# EAGLE design NinjaPCB_ver2.2 (EAGLE 6.6.0)
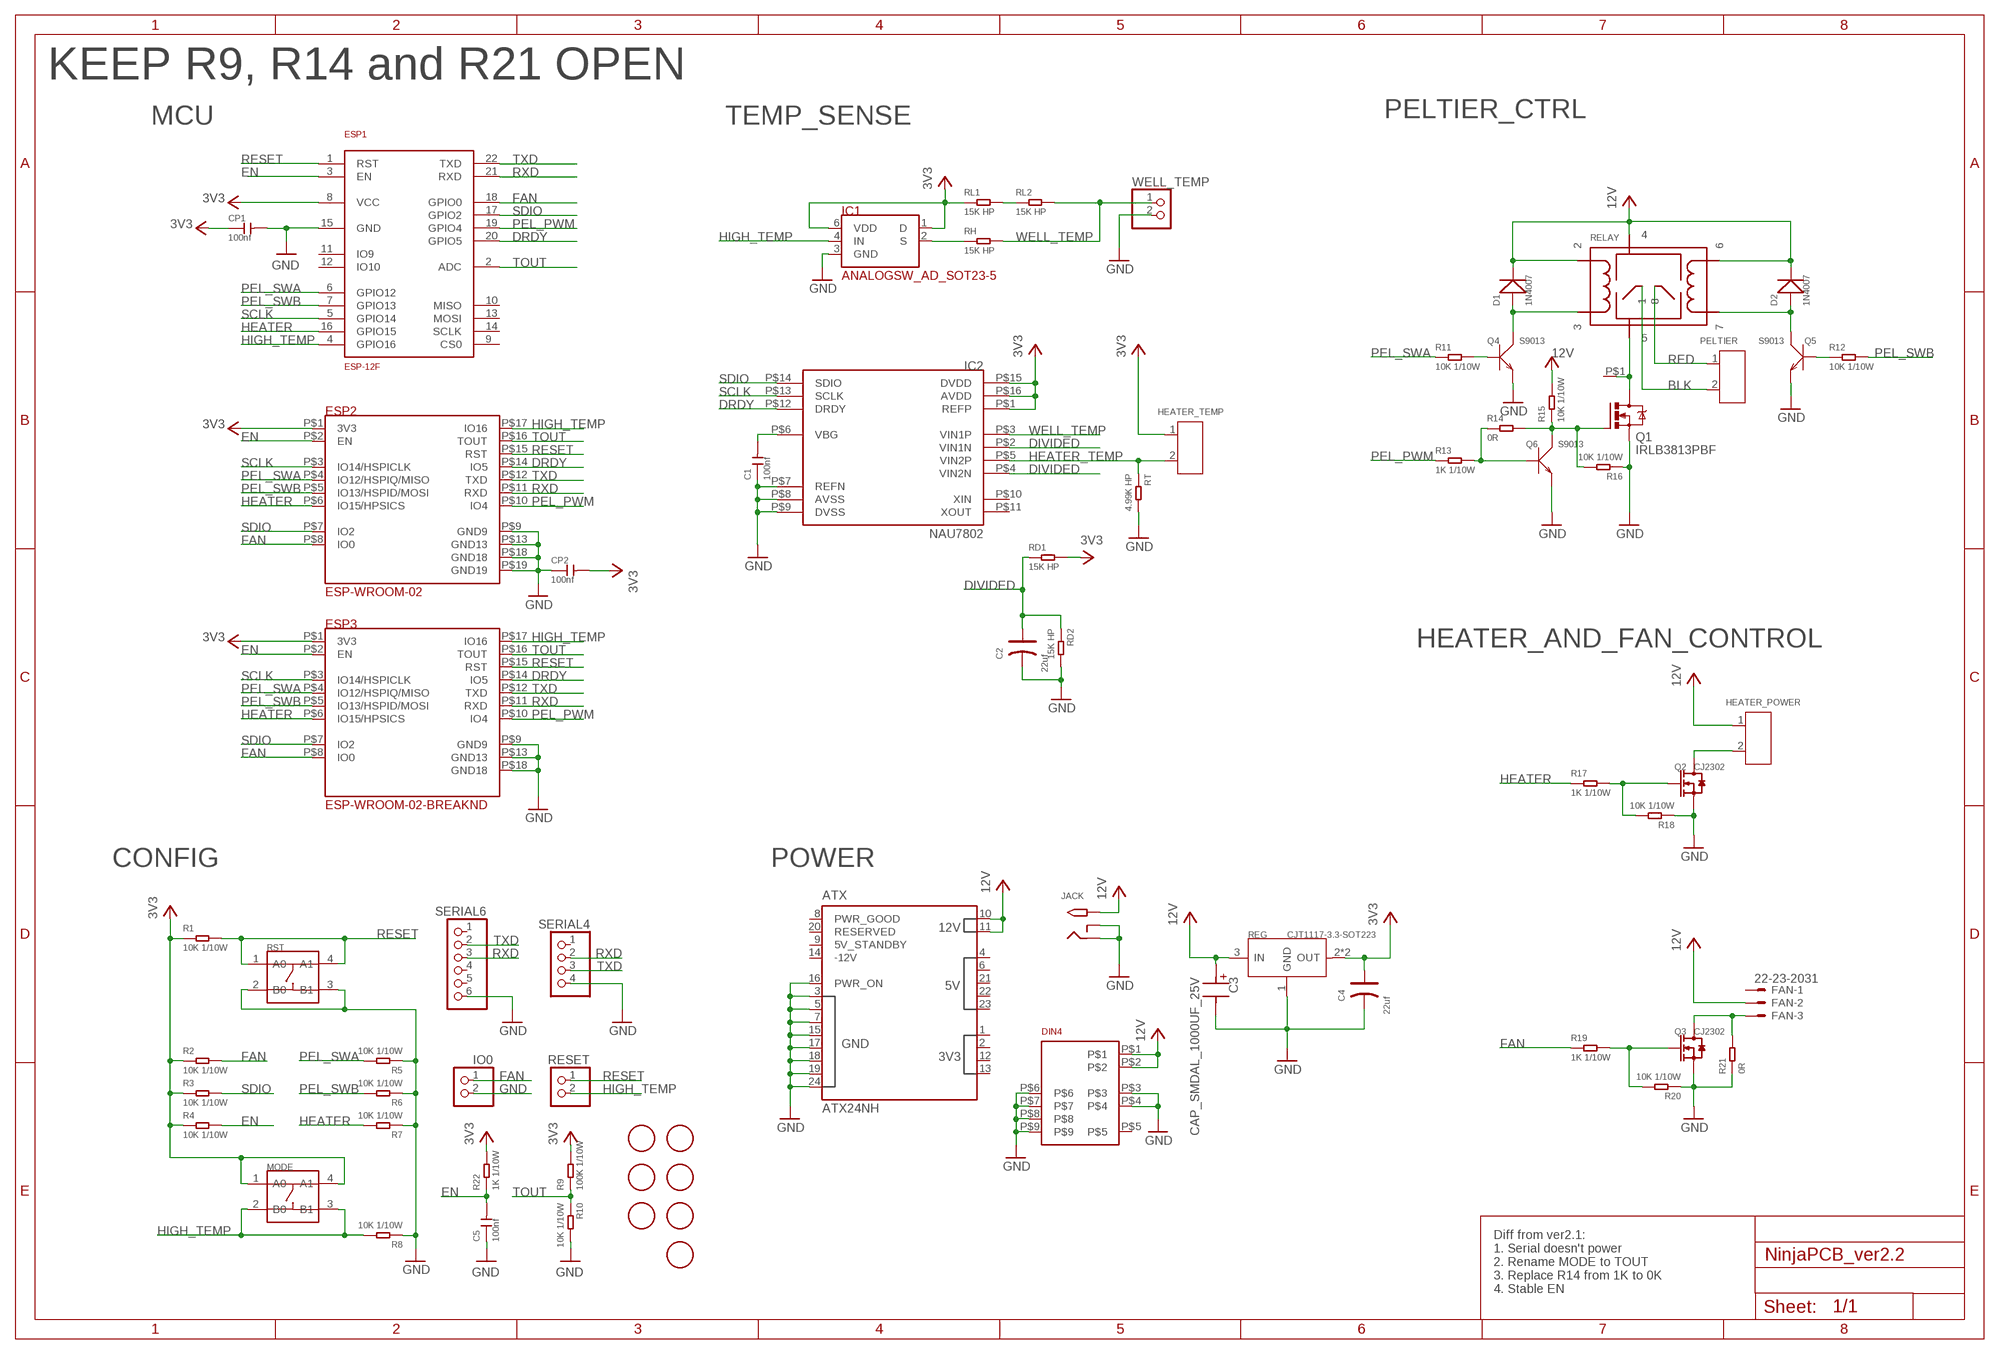
[diagram p0: schematic, sheet 1]

## Parts
ATX  ATX24NH  [ATX24]
C1  100nf  CERAMIC-100NF-50V-10%-X7R(0603)  [C0603]
C2  22uf  TANTALUM-SMD-22UF-16V(AVX-B)  [AVX-B]
C3  CAP_SMDAL_1000UF_25V  [CAP_SMD_AL_D125]
C4  22uf  TANTALUM-SMD-22UF-16V(AVX-B)  [AVX-B]
C5  100nf  CERAMIC-100NF-50V-10%-X7R(0603)  [C0603]
CP1  100nf  CERAMIC-100NF-50V-10%-X7R(0603)  [C0603]
CP2  100nf  CERAMIC-100NF-50V-10%-X7R(0603)  [C0603]
D1  1N4007  DIODE-GEN-PURPOSE-1KV-1A(DO-214AC)  [DO-214AC]
D2  1N4007  DIODE-GEN-PURPOSE-1KV-1A(DO-214AC)  [DO-214AC]
DIN4  DIN4  [DIN4]
ESP1  ESP-12F  [ESP-12F]
ESP2  ESP-WROOM-02  [ESP-WROOM-02]
ESP3  ESP-WROOM-02-BREAKND  [ESP-WROOM-02-BREAK-NODETAIL]
FAN  22-23-2031  [22-23-2031]
HEATER_POWER  SCREW-TERMINAL-GREEN(2P-3.5)  [H2-3.5-7.0X7.0MM]
HEATER_TEMP  SCREW-TERMINAL-GREEN(2P-3.5)  [H2-3.5-7.0X7.0MM]
HEATSINK  HEAT111PB015  [HEAT11PB015]
IC1  ANALOGSW_AD_SOT23-5  [SOT23-5]
IC2  NAU7802  [SOP-16]
IO0  PINHD-1X2  [1X02]
JACK  2.1MMJACKTHM-NOOUT  [PJ-102A-NOOUT]
MODE  DIP-SWITCH-TACTILE-SPST-NO/TS-1109(4P-D6.0MM)'TS-1109'  [SW4-6.0X6.0X5.0MM]
PELTIER  SCREW-TERMINAL-GREEN(2P-3.5)  [H2-3.5-7.0X7.0MM]
Q1  IRLB3813PBF  IRF520  [TO220BV]
Q2  CJ2302  SMD-MOSFET-N-CH-20V-2.1A-CJ2302(SOT-23)  [SOT-23]
Q3  CJ2302  SMD-MOSFET-N-CH-20V-2.1A-CJ2302(SOT-23)  [SOT-23]
Q4  S9013  SMD-TRANSISTORS-NPN-25V-500MA-S9013(SOT-23)  [SOT-23]
Q5  S9013  SMD-TRANSISTORS-NPN-25V-500MA-S9013(SOT-23)  [SOT-23]
Q6  S9013  SMD-TRANSISTORS-NPN-25V-500MA-S9013(SOT-23)  [SOT-23]
R1  10K 1/10W  SMD-RES-10K-5%-1/10W(0603)  [R0603]
R2  10K 1/10W  SMD-RES-10K-5%-1/10W(0603)  [R0603]
R3  10K 1/10W  SMD-RES-10K-5%-1/10W(0603)  [R0603]
R4  10K 1/10W  SMD-RES-10K-5%-1/10W(0603)  [R0603]
R5  10K 1/10W  SMD-RES-10K-5%-1/10W(0603)  [R0603]
R6  10K 1/10W  SMD-RES-10K-5%-1/10W(0603)  [R0603]
R7  10K 1/10W  SMD-RES-10K-5%-1/10W(0603)  [R0603]
R8  10K 1/10W  SMD-RES-10K-5%-1/10W(0603)  [R0603]
R9  100K 1/10W  SMD-RES-100K-5%-1/10W(0603)  [R0603]
R10  10K 1/10W  SMD-RES-10K-5%-1/10W(0603)  [R0603]
R11  10K 1/10W  SMD-RES-10K-5%-1/10W(0603)  [R0603]
R12  10K 1/10W  SMD-RES-10K-5%-1/10W(0603)  [R0603]
R13  1K 1/10W  SMD-RES-1K-5%-1/10W(0603)  [R0603]
R14  0R  SMD-RES-0R-5%-1/10W(0603)  [R0603]
R15  10K 1/10W  SMD-RES-10K-5%-1/10W(0603)  [R0603]
R16  10K 1/10W  SMD-RES-10K-5%-1/10W(0603)  [R0603]
R17  1K 1/10W  SMD-RES-1K-5%-1/10W(0603)  [R0603]
R18  10K 1/10W  SMD-RES-10K-5%-1/10W(0603)  [R0603]
R19  1K 1/10W  SMD-RES-1K-5%-1/10W(0603)  [R0603]
R20  10K 1/10W  SMD-RES-10K-5%-1/10W(0603)  [R0603]
R21  0R  SMD-RES-0R-5%-1/10W(0603)  [R0603]
R22  1K 1/10W  SMD-RES-1K-5%-1/10W(0603)  [R0603]
RD1  15K HP  R0603  [R0603]
RD2  15K HP  R0603  [R0603]
REG  CJT1117-3.3-SOT223  PMIC-CJT1117-3.3(SOT223)  [SOT-223]
RELAY  NEC-RELAY2EP2  [NEC-EP2]
RESET  PINHD-1X2  [1X02]
RH  15K HP  R0603  [R0603]
RL1  15K HP  R0603  [R0603]
RL2  15K HP  R0603  [R0603]
RST  DIP-SWITCH-TACTILE-SPST-NO/TS-1109(4P-D6.0MM)'TS-1109'  [SW4-6.0X6.0X5.0MM]
RT  4.99K HP  SMD-RES-2K-1%-1/10W(0603)  [R0603]
SERIAL4  PINHD-1X4  [1X04]
SERIAL6  PINHD-1X6  [1X06]
U$3  FIDUCIAL  [FIDUCIAL_1MM]
U$4  FIDUCIAL  [FIDUCIAL_1MM]
U$5  FIDUCIAL  [FIDUCIAL_1MM]
U$7  FIDUCIAL  [FIDUCIAL_1MM]
U$8  FIDUCIAL  [FIDUCIAL_1MM]
U$9  FIDUCIAL  [FIDUCIAL_1MM]
U$10  FIDUCIAL  [FIDUCIAL_1MM]
WELL_TEMP  PINHD-1X2/90  [1X02/90]

## Nets
3V3: C4.+ CP1.1 CP2.2 ESP1.8(VCC) ESP2.P$1(3V3) ESP3.P$1(3V3) HEATER_TEMP.1 IC1.1(D) IC1.6(VDD) IC2.P$1(REFP) IC2.P$15(DVDD) IC2.P$16(AVDD) MODE.1(A0) MODE.4(A1) R1.1 R2.1 R3.1 R4.1 R9.2 R22.2 RD1.2 REG.2(OUT) REG.TER(OUT) RL1.1
12V: ATX.10(12V_10) ATX.11(12V_11) C3.P$P D1.2(-) D2.2(-) DIN4.P$1 DIN4.P$2 FAN.2 HEATER_POWER.1 JACK.TIP R15.2 REG.3(IN) RELAY.P$2 RELAY.P$4 RELAY.P$6
BLK: PELTIER.2 RELAY.P$1
DIVIDED: C2.+ IC2.P$2(VIN1N) IC2.P$4(VIN2N) RD1.1 RD2.1
DRDY: ESP1.20(GPIO5) ESP2.P$14(IO5) ESP3.P$14(IO5) IC2.P$12(DRDY)
EN: C5.2 ESP1.3(EN) ESP2.P$2(EN) ESP3.P$2(EN) R4.2 R22.1
FAN: ESP1.18(GPIO0) ESP2.P$8(IO0) ESP3.P$8(IO0) IO0.1 R2.2 R19.1
GND: ATX.3(GND3) ATX.5(GND5) ATX.7(GND7) ATX.15(GND15) ATX.16(PWR_ON) ATX.17(GND17) ATX.18(GND18) ATX.19(GND19) ATX.24(GND24) C1.1 C2.- C3.P$M C4.- C5.1 CP1.2 CP2.1 DIN4.P$3 DIN4.P$4 DIN4.P$6 DIN4.P$7 DIN4.P$8 DIN4.P$9 ESP1.15(GND) ESP2.P$9(GND9) ESP2.P$13(GND13) ESP2.P$18(GND18) ESP2.P$19(GND19) ESP3.P$9(GND9) ESP3.P$13(GND13) ESP3.P$18(GND18) IC1.3(GND) IC2.P$7(REFN) IC2.P$8(AVSS) IC2.P$9(DVSS) IO0.2 JACK.RING JACK.RING_SW Q1.S Q2.2(S) Q3.2(S) Q4.2(E) Q5.2(E) Q6.2(E) R5.1 R6.1 R7.1 R8.1 R10.2 R16.1 R18.1 R20.1 R21.1 RD2.2 REG.1(GND) RST.2(B0) RST.3(B1) RT.2 SERIAL4.4 SERIAL6.6 WELL_TEMP.2
HEATER: ESP1.16(GPIO15) ESP2.P$6(IO15/HPSICS) ESP3.P$6(IO15/HPSICS) R7.2 R17.1
HEATER_TEMP: HEATER_TEMP.2 IC2.P$5(VIN2P) RT.1
HIGH_TEMP: ESP1.4(GPIO16) ESP2.P$17(IO16) ESP3.P$17(IO16) IC1.4(IN) MODE.2(B0) MODE.3(B1) R8.2 RESET.2
N$1: RL1.2 RL2.1
N$2: HEATER_POWER.2 Q2.3(D)
N$3: HEATSINK.P$1 Q1.D RELAY.P$5
N$4: FAN.3 Q3.3(D) R21.2
N$5: Q1.G Q6.3(C) R14.2 R15.1 R16.2
N$8: Q3.1(G) R19.2 R20.2
N$27: IC1.2(S) RH.1
N$30: Q6.1(B) R13.2 R14.1
N$32: Q2.1(G) R17.2 R18.2
N$33: D1.1(+) Q4.3(C) RELAY.P$3
N$34: Q4.1(B) R11.2
N$35: Q5.1(B) R12.1
N$36: D2.1(+) Q5.3(C) RELAY.P$7
N$92: C1.2 IC2.P$6(VBG)
PEL_PWM: ESP1.19(GPIO4) ESP2.P$10(IO4) ESP3.P$10(IO4) R13.1
PEL_SWA: ESP1.6(GPIO12) ESP2.P$4(IO12/HSPIQ/MISO) ESP3.P$4(IO12/HSPIQ/MISO) R5.2 R11.1
PEL_SWB: ESP1.7(GPIO13) ESP2.P$5(IO13/HSPID/MOSI) ESP3.P$5(IO13/HSPID/MOSI) R6.2 R12.2
RED: PELTIER.1 RELAY.P$8
RESET: ESP1.1(RST) ESP2.P$15(RST) ESP3.P$15(RST) R1.2 RESET.1 RST.1(A0) RST.4(A1)
RXD: ESP1.21(RXD) ESP2.P$11(RXD) ESP3.P$11(RXD) SERIAL4.2 SERIAL6.3
SCLK: ESP1.5(GPIO14) ESP2.P$3(IO14/HSPICLK) ESP3.P$3(IO14/HSPICLK) IC2.P$13(SCLK)
SDIO: ESP1.17(GPIO2) ESP2.P$7(IO2) ESP3.P$7(IO2) IC2.P$14(SDIO) R3.2
TOUT: ESP1.2(ADC) ESP2.P$16(TOUT) ESP3.P$16(TOUT) R9.1 R10.1
TXD: ESP1.22(TXD) ESP2.P$12(TXD) ESP3.P$12(TXD) SERIAL4.3 SERIAL6.2
WELL_TEMP: IC2.P$3(VIN1P) RH.2 RL2.2 WELL_TEMP.1
Unconnected: ATX.1(3V3_1) ATX.2(3V3_2) ATX.4(5V_4) ATX.6(5V_6) ATX.8(PWR_GOOD) ATX.9(5V_STANDBY) ATX.12(3V3_12) ATX.13(3V3_13) ATX.14(-12V) ATX.20(RESERVED) ATX.21(5V_21) ATX.22(5V_22) ATX.23(5V_23) DIN4.P$5 ESP1.9(CS0) ESP1.10(MISO) ESP1.11(IO9) ESP1.12(IO10) ESP1.13(MOSI) ESP1.14(SCLK) FAN.1 IC2.P$10(XIN) IC2.P$11(XOUT) SERIAL4.1 SERIAL6.1 SERIAL6.4 SERIAL6.5

## Notes on the sheet
- KEEP R9, R14 and R21 OPEN
- MCU | TEMP_SENSE | PELTIER_CTRL
- HEATER_AND_FAN_CONTROL
- CONFIG | POWER
- Diff from ver2.1: 
  1. Serial doesn't power
  2. Rename MODE to TOUT
  3. Replace R14 from 1K to 0K
  4. Stable EN

## Library data of the parts
ATX = PCR-Connector:ATX24
C1 C5 CP1 CP2 = Seeed-Capacitor:CERAMIC-100NF-50V-10%-X7R(0603): 302010138; MPN: CC0603KRX7R9BB104
C2 C4 = Seeed-Capacitor:TANTALUM-SMD-22UF-16V(AVX-B): 302020013; MPN: TAJB226*016#NJ
C3 = Seeed-OPL-2017-01-Capacitor-akita:CAP_SMDAL_1000UF_25V: SMD CAP Aluminum 1000uF-25V;D12.5*H13.5mm SKU: 302030098
D1 D2 = Seeed-Diode:DIODE-GEN-PURPOSE-1KV-1A(DO-214AC): 304010013; MPN: 1N4007
DIN4 = PCR-Connector:DIN4
ESP1 = Seeed-OPL-2017-01-Sensor-camilo:ESP-12F: 317060163
ESP2 = PCR-Module:ESP-WROOM-02
ESP3 = PCR-Module:ESP-WROOM-02-BREAK
FAN = con-molex:22-23-2031: .100" (2.54mm) Center Header - 3 Pin; MF: MOLEX; MPN: 22-23-2031; OC_FARNELL: 1462950; OC_NEWARK: 30C0862
HEATER_POWER HEATER_TEMP PELTIER = Seeed-Connector:SCREW-TERMINAL-GREEN(2P-3.5): 320110028; VALUE: GREEN-2P-3.5
HEATSINK = PCR-Connector:HEAT1
IC1 = PCR-IC:ANALOGSW_AD_SOT23-5
IC2 = PCR-IC:NAU7802
IO0 RESET WELL_TEMP = pinhead:PINHD-1X2: PIN HEADER
JACK = adafruit:2.1MMJACK: 2.1mm x 5.5mm THM DC jack with internal switch. Digikey part #PJ-102A, 4UCON part #05537 2.1mm x 5.5mm SMT DC jack with internal switch. Digikey part #PJ-002A-SMT, 4UCON part #03267 By microbuilder.eu & adafruit.com
MODE RST = Seeed-Switch:DIP-SWITCH-TACTILE-SPST-NO/TS-1109(4P-D6.0MM): 311020024
Q1 = transistor-power:IRF520: HEXFET Power MOSFET
Q2 Q3 = Seeed-Transistor:SMD-MOSFET-N-CH-20V-2.1A-CJ2302(SOT-23): 305030015; MPN: CJ2302
Q4-Q6 = Seeed-Transistor:SMD-TRANSISTORS-NPN-25V-500MA-S9013(SOT-23): 305010018; MPN: S9013
R1-R8 R10-R12 R15 R16 R18 R20 = Seeed-Resistor:SMD-RES-10K-5%-1/10W(0603): 301010293; MPN: RC0603JR-0710KL
R9 = Seeed-Resistor:SMD-RES-100K-5%-1/10W(0603): 301010089; MPN: RC0603JR-07100KL
R13 R17 R19 R22 = Seeed-Resistor:SMD-RES-1K-5%-1/10W(0603): 301010291; MPN: RC0603JR-071KL
R14 R21 = Seeed-Resistor:SMD-RES-0R-5%-1/10W(0603): 301010292; MPN: RC0603JR-070RL
RD1 RD2 RH RL1 RL2 = PCR-RCL:R
REG = Seeed-IC:PMIC-CJT1117-3.3(SOT223): 310030097; MPN: CJT1117-3.3
RELAY = PCR-Switch:NEC-RELAY2
RT = Seeed-Resistor:SMD-RES-2K-1%-1/10W(0603): 301010221; MPN: RC0603FR-072KL; VALUE: 2K
SERIAL4 = pinhead:PINHD-1X4: PIN HEADER
SERIAL6 = pinhead:PINHD-1X6: PIN HEADER
U$3-U$5 U$7-U$10 = adafruit:FIDUCIAL: For use by pick and place machines to calibrate the vision/machine, 1mm By microbuilder.eu

## Net classes
1 2A: width 0.406 mm
2 8A: width 2.54 mm

## Board
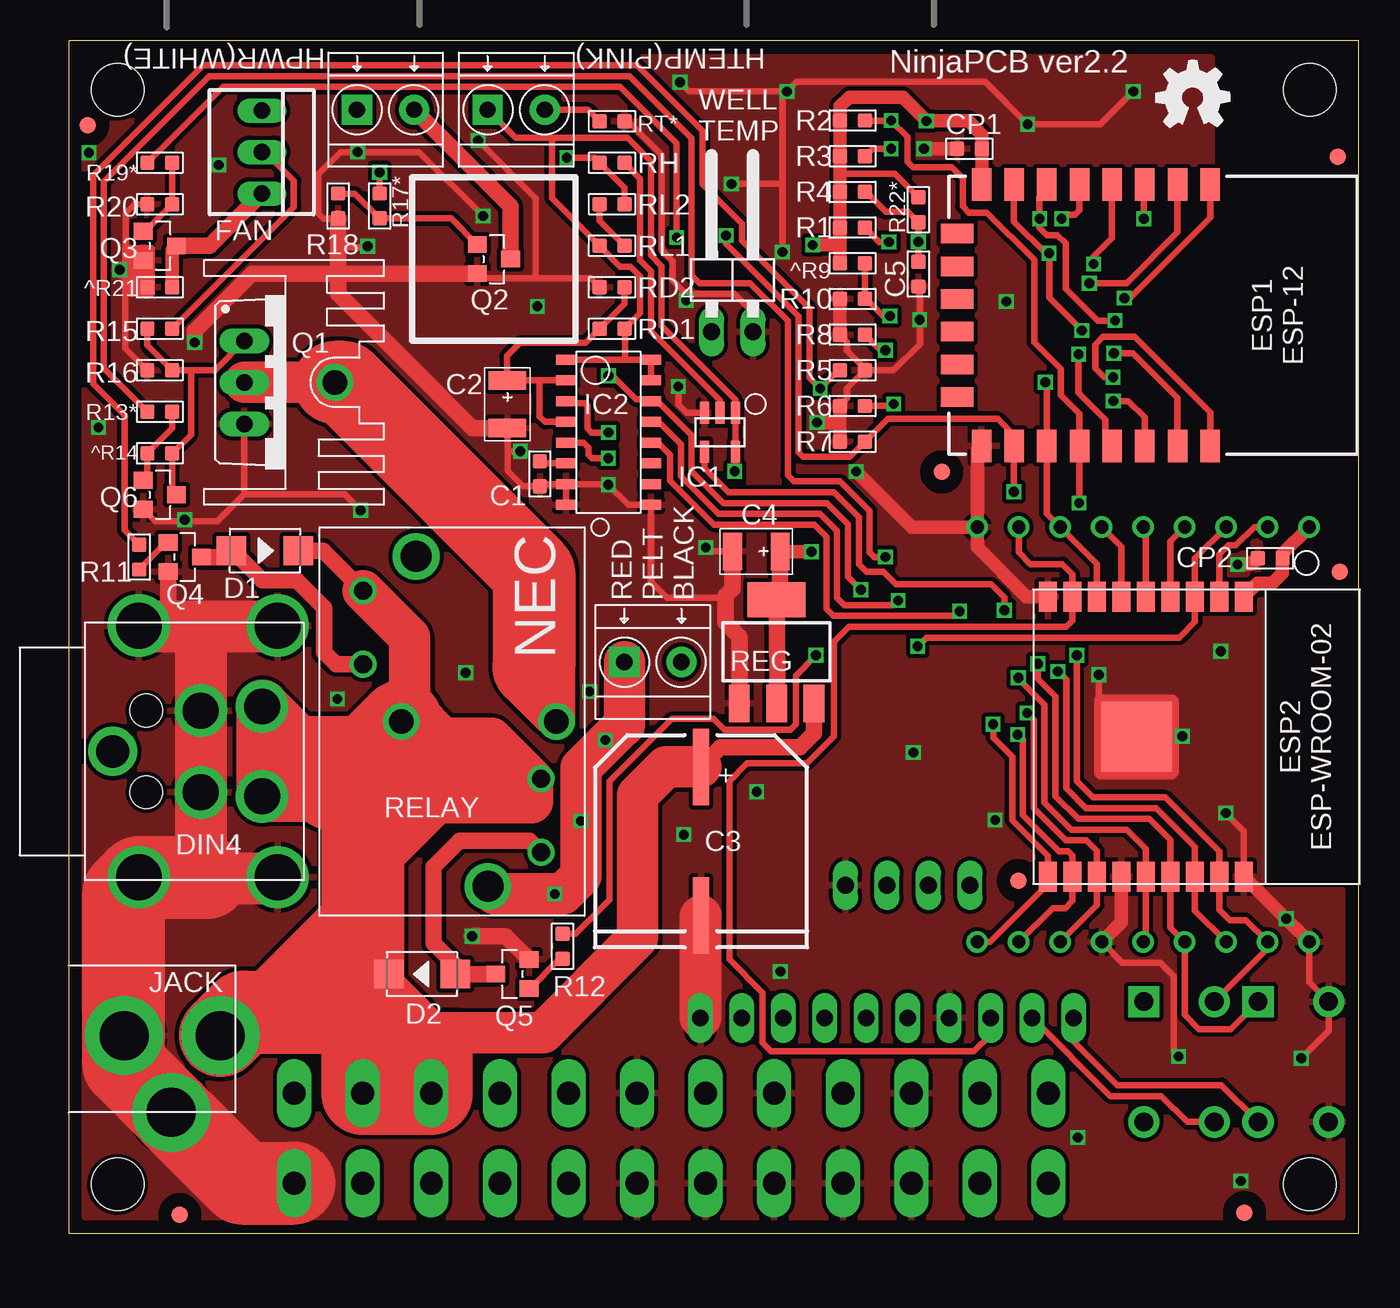
[diagram p1: board, top side]
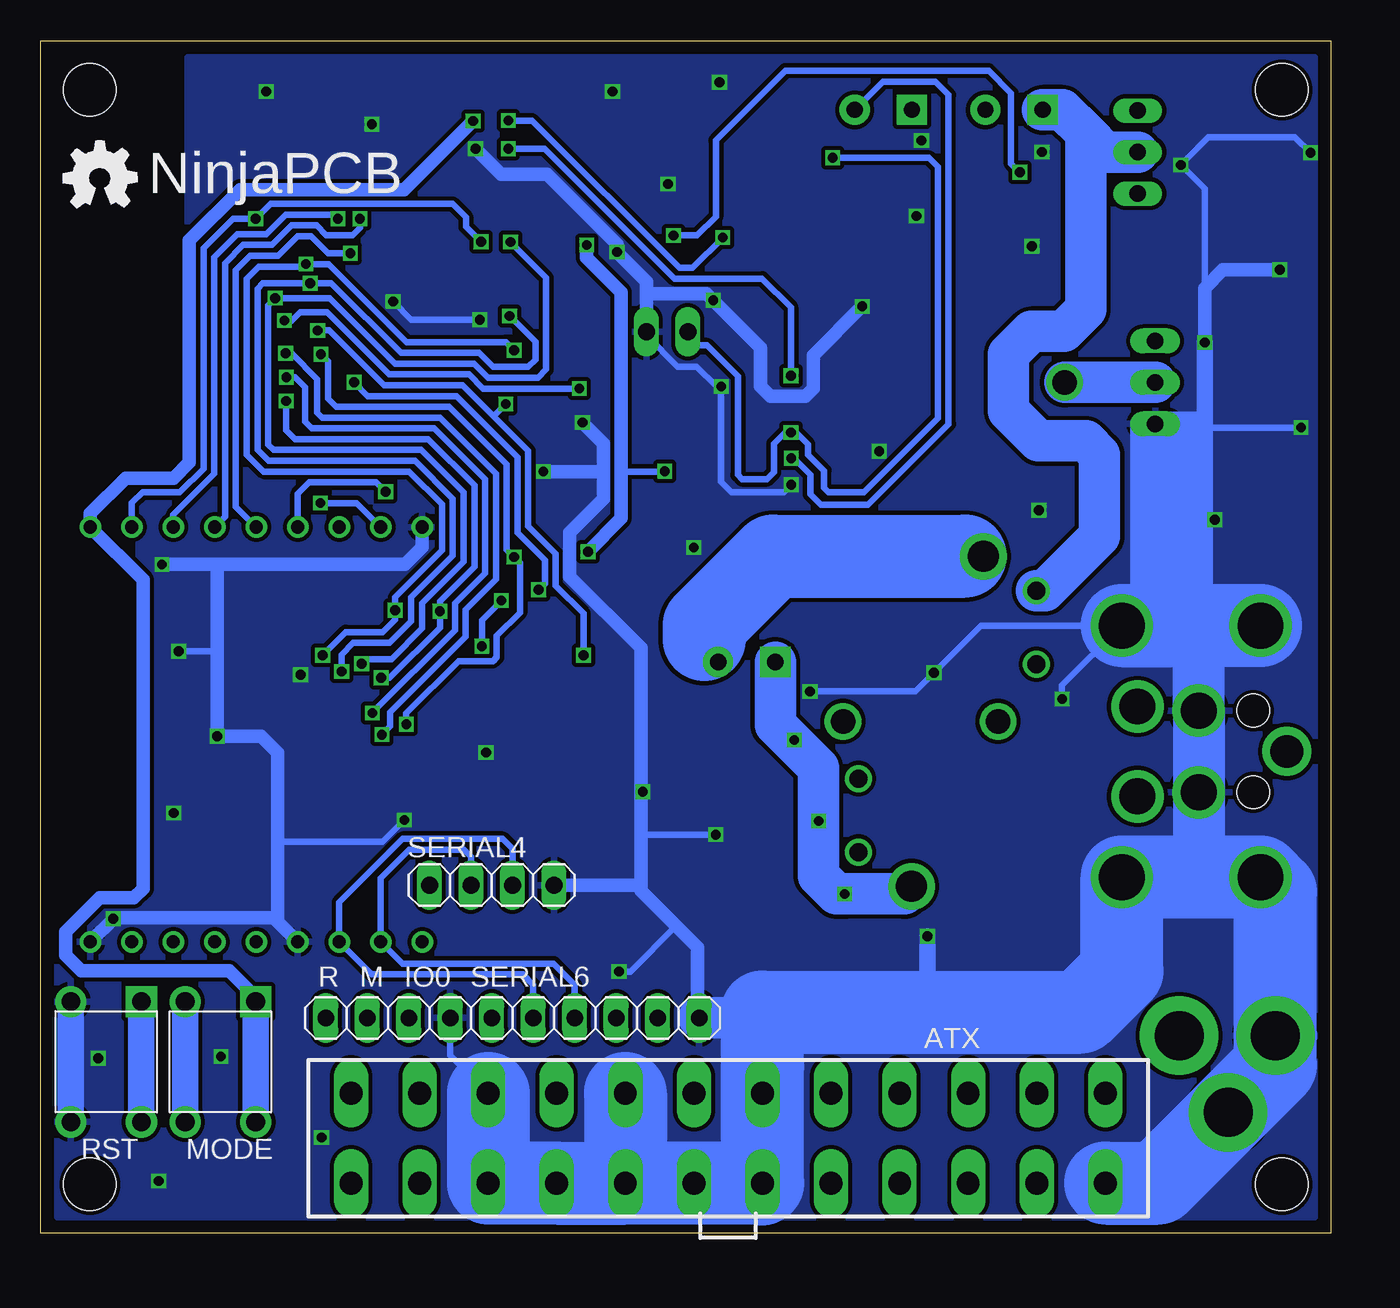
[diagram p2: board, bottom side, seen from below]

Size 79 x 73 mm. Coordinates in mm from the lower left corner, seen from the top.
Outline: 0,0 79,0 79,73 0,73 0,0
Copper layers (1*16): Top 0.035mm / dielectric 1.5mm / Bottom 0.035mm
Design rules "SeeedStudio_2oz": minimum track width 6mil, minimum drill 12mil, track to track 10mil, track to pad 10mil, pad to pad 10mil, via to via 10mil, smd to smd 0mil, copper to edge 10mil, drill to drill 10mil, minimum pad ring 10mil, minimum via ring 6mil, stop-mask expansion 2mil, vias tented up to drill 100mil, thermal gap 10mil
Holes 3.2 mm at 3,3 3,70 76,70 76,3
tKeepout: area 1.4,1.4 to 4.6,4.6; area 74.4,1.4 to 77.6,4.6; area 74.4,68.4 to 77.6,71.6; area 1.4,68.4 to 4.6,71.6

### Footprints (pad centres in the part's own frame; a part is rotated, then mirrored left to right if it is on the bottom)
ATX24 = drill 1.4 long: 1 23.1,-2.75; 2 18.9,-2.75; 3 14.7,-2.75; 4 10.5,-2.75; 5 6.3,-2.75; 6 2.1,-2.75; 7 -2.1,-2.75; 8 -6.3,-2.75; 9 -10.5,-2.75; 10 -14.7,-2.75; 11 -18.9,-2.75; 12 -23.1,-2.75; 13 23.1,2.75; 14 18.9,2.75; 15 14.7,2.75; 16 10.5,2.75; 17 6.3,2.75; 18 2.1,2.75; 19 -2.1,2.75; 20 -6.3,2.75; 21 -10.5,2.75; 22 -14.7,2.75; 23 -18.9,2.75; 24 -23.1,2.75
C0603 = smd 0.889 x 0.889: 1 0,0.762; 2 0,-0.762
AVX-B = smd 1.143 x 2.286: + -1.46,0; - 1.46,0
CAP_SMD_AL_D125 = smd 1 x 4.7: P$M 0,-4.55; P$P 0,4.55
DO-214AC = smd 1.8 x 1.77: 1 -2.042,0; 2 2.042,0
DIN4 = drill 2.2: P$1 -2.75,10.85; P$2 2.75,10.85; P$3 -2.5,7.1; P$4 2.5,7.1 | drill 2: P$5 0,1.7 | drill 2.8: P$6 -7.7,11.8; P$7 -7.7,3.3; P$8 7.7,3.3; P$9 7.7,11.8 | hole 2: -2.5,3.75; 2.5,3.75
ESP-12F = smd 2 x 1.2: 1 -8,3.48; 2 -8,1.48; 3 -8,-0.52; 4 -8,-2.52; 5 -8,-4.52; 6 -8,-6.52; 7 -8,-8.52; 8 -8,-10.52; 15 8,-10.52; 16 8,-8.52; 17 8,-6.52; 18 8,-4.52; 19 8,-2.52; 20 8,-0.52; 21 8,1.48; 22 8,3.48 | smd 1.2 x 2: 9 -5,-12; 10 -3,-12; 11 -1,-12; 12 1,-12; 13 3,-12; 14 5,-12
ESP-WROOM-02 = smd 1.85 x 1.1: P$1 -8.575,12.9; P$2 -8.575,11.4; P$3 -8.575,9.9; P$4 -8.575,8.4; P$5 -8.575,6.9; P$6 -8.575,5.4; P$7 -8.575,3.9; P$8 -8.575,2.4; P$9 -8.575,0.9; P$10 8.575,0.9; P$11 8.575,2.4; P$12 8.575,3.9; P$13 8.575,5.4; P$14 8.575,6.9; P$15 8.575,8.4; P$16 8.575,9.9; P$17 8.575,11.4; P$18 8.575,12.9 | smd 4.3 x 4.3: P$19 0,6.33
ESP-WROOM-02-BREAK-NODETAIL = drill 0.8: P$1 -12.7,10.16; P$2 -12.7,7.62; P$3 -12.7,5.08; P$4 -12.7,2.54; P$5 -12.7,0; P$6 -12.7,-2.54; P$7 -12.7,-5.08; P$8 -12.7,-7.62; P$9 -12.7,-10.16; P$10 12.7,-10.16; P$11 12.7,-7.62; P$12 12.7,-5.08; P$13 12.7,-2.54; P$14 12.7,0; P$15 12.7,2.54; P$16 12.7,5.08; P$17 12.7,7.62; P$18 12.7,10.16
22-23-2031 = drill 1 long: 1 -2.54,0; 2 0,0; 3 2.54,0
H2-3.5-7.0X7.0MM = drill 1 pad 1.85 square: 1 -1.75,0 | drill 1 pad 1.85: 2 1.75,0
HEAT11PB015 = drill 1.5: P$1 0,3
SOT23-5 = smd 1.321 x 0.559: 1 -1.194,0.95; 2 -1.194,0; 3 -1.194,-0.95; 4 1.194,-0.95; 6 1.194,0.95
SOP-16 = smd 0.6 x 1.2: P$1 -4.445,-2.6; P$2 -3.175,-2.6; P$3 -1.905,-2.6; P$4 -0.635,-2.6; P$5 0.635,-2.6; P$6 1.905,-2.6; P$7 3.175,-2.6; P$8 4.445,-2.6; P$9 4.445,2.6; P$10 3.175,2.6; P$11 1.905,2.6; P$12 0.635,2.6; P$13 -0.635,2.6; P$14 -1.905,2.6; P$15 -3.175,2.6; P$16 -4.445,2.6
1X02 = drill 1.016 long: 1 -1.27,0; 2 1.27,0
PJ-102A-NOOUT = drill 3 pad 4.8: RING 0.1,-3.39; RING_SW -4.6,-6.29; TIP 0.1,-9.29
SW4-6.0X6.0X5.0MM = drill 1.143 pad 1.905 square: 1 -3.683,2.159 | drill 1.143 pad 1.905: 2 -3.683,-2.159; 3 3.683,-2.159; 4 3.683,2.159
TO220BV = drill 1.016 long: D 0,-2.54; G -2.54,-2.54; S 2.54,-2.54
SOT-23 = smd 1.016 x 1.143: 1 -0.889,-1.016; 2 0.889,-1.016; 3 0,1.016
R0603 = smd 0.889 x 0.889: 1 0,0.762; 2 0,-0.762
SOT-223 = smd 1.27 x 2.286: 1 -2.286,-3.175; 2 0,-3.175; 3 2.286,-3.175 | smd 3.556 x 2.159: TER 0,3.175
NEC-EP2 = drill 1.9: P$1 -10.1,-2.2; P$8 10.1,2.2 | drill 1.1: P$2 -8,-5.45; P$3 -3.5,-5.45; P$6 3.5,5.45; P$7 8,5.45 | drill 1.5: P$4 0,-3.1; P$5 0,6.4
1X04 = drill 1.016 long: 1 -3.81,0; 2 -1.27,0; 3 1.27,0; 4 3.81,0
1X06 = drill 1.016 long: 1 -6.35,0; 2 -3.81,0; 3 -1.27,0; 4 1.27,0; 5 3.81,0; 6 6.35,0
FIDUCIAL_1MM = smd 1 x 1: 1 0,0
1X02/90 = drill 1.016 long: 1 -1.27,-3.81; 2 1.27,-3.81

### Placement (x,y rotation side)
ATX  36.91,5.82 180 bottom
C1  28.86,46.49 180 top
C2  26.87,50.75 270 top
C3  38.73,24 0 top
C4  42.11,41.74 180 top
C5  52.04,58.72 180 top
CP1  55.16,66.4 270 top
CP2  73.57,41.32 90 top
D1  12.02,41.79 0 top
D2  21.64,15.88 180 top
DIN4  1,29.5 270 top
ESP1  66.42,56.2 270 top
ESP2  59.08,30.4 270 top
ESP3  65.8,30.54 270 top
FAN  11.83,66.19 270 top
HEATER_POWER  19.41,68.78 0 top
HEATER_TEMP  27.41,68.78 0 top
HEATSINK  13.3,52.09 270 top
IC1  39.88,49.04 270 top
IC2  33.06,49.04 270 top
IO0  55.19,13.18 0 bottom
JACK  0,12 90 top
MODE  68,10.5 270 bottom
PELTIER  35.77,34.97 0 top
Q1  13.3,52.09 270 top
Q2  26.04,59.63 270 top
Q3  5.59,60.45 270 top
Q4  7.11,41.4 270 top
Q5  27.18,15.88 90 top
Q6  5.59,45.21 270 top
R1  48.01,61.57 90 top
R2  48.01,68.12 90 top
R3  48.01,65.94 90 top
R4  48.01,63.75 90 top
R5  48.01,52.83 270 top
R6  48.01,50.65 90 top
R7  48.01,48.46 90 top
R8  48.01,55.02 90 top
R9  48.01,59.39 270 top
R10  48.01,57.2 270 top
R11  4.32,41.4 0 top
R12  30.25,17.58 180 top
R13  5.59,50.29 90 top
R14  5.59,47.75 90 top
R15  5.59,55.37 90 top
R16  5.59,52.83 90 top
R17  19.05,62.89 0 top
R18  16.51,62.89 180 top
R19  5.59,65.53 90 top
R20  5.59,62.99 90 top
R21  5.59,57.91 90 top
R22  52.04,62.66 180 top
RD1  33.27,55.37 90 top
RD2  33.27,57.91 270 top
REG  43.36,35.61 0 top
RELAY  23.48,31.34 270 top
RESET  60.27,13.18 0 bottom
RH  33.27,65.53 270 top
RL1  33.27,60.45 90 top
RL2  33.27,62.99 90 top
RST  75,10.5 270 bottom
RT  33.27,68.07 90 top
SERIAL4  51.38,21.31 0 bottom
SERIAL6  45.03,13.18 0 bottom
U$1  [OSHW_5MM]  68.83,69.52 0 top
U$2  [OSHW_5MM]  75.39,64.59 0 bottom
U$3  77.72,65.91 270 top
U$4  6.81,1.14 0 top
U$5  72.01,1.27 0 top
U$7  1.17,67.84 0 top
U$8  58.17,21.59 270 top
U$9  53.47,46.61 270 top
U$10  77.85,40.51 270 top
WELL_TEMP  40.64,59 0 top

### Tracks (layer width: path | path; a pad name or v marks a point on that pad's centre or on a via)
3V3  (via drill 0.6)
  Top 0.406: IC2.P$1 34.09,53.48 | 34.09,53.48 IC2.P$16 IC2.P$15 | 34.09,53.48 34.09,55.32 RD1.2 35,56.34 35,58.6 34.42,59.18 33.78,59.18 RL1.1 29.59,63.37 29.59,67.08 | HEATER_TEMP.1 27.36,67.08 29.59,67.08 | 29.59,67.08 34.21,67.08 35.66,65.63 35.66,59.87 36.32,59.21 36.32,55.55 40.83,51.04 IC1.1 IC1.6 40.83,46.66 v40.79,46.66 | R22.2 50.6,64.87 47.24,64.87
  Top 0.813: 43.35,34.1 43.41,34.16 | C4.+ 43.66,41.73 v45.49,41.73 | ESP1.8 55.93,64.2 CP1.1 55.93,67.26 55.09,68.1 v52.53,68.1 51.08,69.55 47.8,69.55 47.24,68.99 R2.1 R3.1 47.24,64.87 R4.1 R1.1 47.24,60.5 | ESP2.P$1 72.8,39.8 73.71,39.8 74.31,40.4 CP2.2 74.34,41.61 ESP3.P$1 | v45.57,60.5 47.24,60.5 | R9.2 47.24,60.5
  Top 1.016: REG.2 43.41,34.16 REG.TER 43.58,39.01 C4.+
  Bottom 0.406: 45.49,41.83 v45.49,41.73 | v40.79,46.66 40.82,46.63 43.46,46.63
  Bottom 0.813: v45.49,41.73 43.46,43.76 43.46,46.63 43.46,57.61 45.57,59.72 v45.57,60.5 | MODE.1 65.84,14.46 67.46,16.08 76.53,16.08 77.47,17.02 77.47,18.47 75.39,20.55 73.3,20.55 72.75,21.11 72.75,40.02 ESP3.P$1 75.96,44.08 73.81,46.23 70.87,46.23 69.9,47.19 69.9,60.78 66.8,63.88 56.74,63.88 v52.53,68.1
  Bottom 1.626: MODE.4 MODE.1
12V
  Top 0.254: 28.37,27.84 28.36,27.84 28.36,27.85 | 19.25,15.21 20.4,15.21 20.4,12.29 | 17.2,20.02 18.01,20.02 18.01,20.24
  Top 0.406: FAN.2 12.05,66.19 13.79,64.44 13.79,62.81 R15.2 | DIN4.P$1 11.86,32.26 | 23.5,8.56 22.22,8.56 ATX.10
  Top 0.508: 16.05,27.23 16.48,27.23 16.71,27.46
  Top 1.016: RELAY.P$2 15.58,41.79 D1.2 | D2.2 19.53,15.74 17.32,13.54 17.5,13.36 17.5,12.9 18.01,12.39 ATX.11 | REG.3 45.65,30.61 44.78,29.74 39.91,29.74 C3.P$P
  Top 1.27: 28.37,27.84 RELAY.P$6
  Top 2.54: RELAY.P$2 20.88,36.49 20.88,32.21 20.38,31.71 RELAY.P$4 23.88,27.84 28.37,27.84 | 23.72,12.29 23.5,12.06 23.5,8.56 | 23.72,12.29 20.4,12.29 | 23.72,12.29 29.06,12.29 34.85,18.09 34.85,26.82 36.58,28.55 C3.P$P | 18.62,20.75 18.62,22.45 23.39,27.23 21.06,27.23 20.75,26.92 20.75,27.64 21.34,28.22 23.19,26.36 28.35,26.36 28.4,26.42 28.4,27.81 28.36,27.85 25.91,30.3 22.91,30.3 21.08,32.13 20.73,32.13 19,30.4 14.02,30.4 | 19.25,21.39 19.25,15.21 21.89,12.57 | 17.2,23.27 17.2,20.02 12.06,14.88 14.55,14.88 15.6,15.93
  Top 3.175: 15.36,26.75 DIN4.P$2 DIN4.P$1 | 11.89,32.23 11.86,32.26 11.86,32.31 16.71,27.46 | 13.01,28.73 13.56,28.17 14.15,28.17
  Top 5.08: ATX.10 ATX.11 18.01,20.24 18.01,26.16 16.71,27.46 | RELAY.P$4 16.27,27.23 16.05,27.23 15.11,28.17 14.15,28.17 | JACK.TIP 10.73,13.54 17.32,13.54 17.45,13.54
  Bottom 2.54: 15.01,67.36 15.01,56.57 16.36,55.22 18.34,55.22 19.74,53.82 19.74,50.34 17.91,48.51 15.01,48.51 14.17,47.68 14.17,42.67 17.51,39.34 RELAY.P$2 | 15.01,67.36 16.43,68.78 HEATER_POWER.1 | 15.01,67.36 13.84,66.19 FAN.2
BLK
  Bottom 0.508: 38.38,36.35 37.52,35.49 PELTIER.2 | 22.4,41.45 22.39,41.44 RELAY.P$1
  Bottom 5.08: 38.38,36.35 38.38,37.24 34.16,41.45 22.4,41.45
DIVIDED
  Top 0.406: IC2.P$2 28.8,52.21 | 28.8,52.21 C2.+ 26.85,52.24 26.85,53.72 27.64,54.51 31.65,54.51 RD1.1 34.04,56.9 RD2.1 | IC2.P$4 29.17,49.67 28.85,49.99 28.85,52.16 28.8,52.21
DRDY  (via drill 0.6)
  Top 0.406: IC2.P$12 36.1,48.4 36.83,47.68 36.83,46.08 39.52,43.38 45.67,43.38 46.41,42.65 46.41,38.23 46.84,37.8 54.28,37.8 v54.56,38.08 | ESP3.P$14 65.98,18.01 ESP2.P$14 65.98,23.53 64.8,24.71 61.42,24.71 59.77,26.36 59.77,32.36 58.17,33.96 v58.17,34.01 | ESP1.20 65.9,49.95 64.9,50.95 v63.98,50.95
  Bottom 0.406: v63.98,50.95 63.98,49.17 63.42,48.62 55.27,48.62 52.45,45.8 52.45,40.79 54.56,38.68 v54.56,38.08 54.56,37.08 57.63,34.01 v58.17,34.01
EN  (via drill 0.6)
  Top 0.406: ESP2.P$2 70.48,41.57 71.02,42.11 71.48,42.11 72.6,43.24 ESP3.P$2 | ESP1.3 65.84,64.14 v65.84,62.1 | R4.2 48.82,63.75 50.04,62.53 51.41,62.53 R22.1 v52.05,60.69 C5.2
  Bottom 0.406: ESP3.P$2 73.42,44.71 72.77,45.36 70.48,45.36 69.04,46.81 69.04,60.3 67.23,62.1 v65.84,62.1 64.92,63.02 53.77,63.02 52.96,62.2 52.96,61.61 v52.05,60.69
FAN  (via drill 0.6)
  Top 0.406: R19.1 9.47,70.18 33.78,70.18 37.24,66.73 v37.24,60.96 | ESP3.P$8 58.18,41.69 58.9,40.97 60.86,40.97 61.48,40.35 ESP2.P$8 61.48,37.5 61.11,37.13 47.78,37.13 46.86,36.22 46.86,30.43 45.21,28.78 41.55,28.78 40.46,27.69 40.46,16.76 42.49,14.73 42.49,11.66 43,11.15 55.45,11.15 56.46,12.17 IO0.1 | v61.87,44.7 61.9,44.73 ESP1.18 61.9,50.16 60.76,51.31 60.76,52.93 59.13,54.56 59.13,59.59 56.24,62.48 55.14,62.48 54.76,62.87 54.76,64.59 54.1,65.25 51.71,65.25 51.36,65.61 51.36,67.13 v50.37,68.12 R2.2
  Bottom 0.406: ESP3.P$8 59.65,44.7 v61.87,44.7 | v37.24,60.96 39.09,59.11 39.9,59.11 48.92,68.12 v50.37,68.12
GND  (via drill 0.6)
  Top 0.406: Q6.2 5.31,43.59 7.01,43.59 | 7.01,43.59 9.09,43.59 10.76,45.26 | 10.76,45.26 Q1.S | 4.83,59.31 Q3.2 | R20.1 4.04,62.99 3.5,62.46 3.5,60.33 | 4.29,59.56 Q3.2 | 3.5,60.33 4.06,59.77 4.37,59.77 Q3.2 | R21.1 4.8,57.91 4.78,57.89 | 5.08,58.42 5.08,57.53 3.48,57.53 | 3.48,57.53 3.48,60.3 | 3.48,60.3 3.76,60.3 3.76,59.38 3.79,59.38 3.79,60.3 5.08,60.3 5.08,59.74 4.01,59.74 4.01,60.07 4.57,60.07 4.57,60.05 | IC2.P$8 IC2.P$7 | IC2.P$7 28.99,45.86 C1.1 27.83,45.73 26.87,46.69 26.87,47.88 | 26.87,47.88 C2.- | RD2.2 31.95,58.47 28.6,58.47 | 28.6,58.47 25.3,58.47 Q2.2 | IC2.P$7 33,45.86 v33.05,45.82 34.27,44.59 IC2.P$9 35.66,39.9 36.65,38.91 40.11,38.91 40.23,39.04 | v37.34,51.84 37.34,51.33 37.34,50.93 37.34,50.72 37.83,50.23 IC1.3 | RT.2 34.27,68.07 36.32,66.02 36.32,60.2 36.98,59.54 36.98,58.34 37.82,57.51 38.1,57.51 | 38.1,57.51 40.77,57.51 41.91,56.36 WELL_TEMP.2 | ESP3.P$18 75.96,15.38 RST.2 77.16,12.39 v75.49,10.72 | 4.32,21.79 5.49,21.79 5.56,21.72 | 63.25,28.19 65.96,28.19 v68.2,30.43 | 3.76,58.75 3.66,58.75 | 3.48,60.3 3.5,60.33 | 47.24,57.05 R10.2 | v18.31,60.43 18.26,60.38 16.51,60.38 | v43.99,69.9 43.71,69.62 43.71,64.24 | 43.71,64.24 v43.71,60.07 | v43.99,69.9 44.58,70.48 56.13,70.48 v58.73,67.89 63.2,67.89 v65.2,69.9 | v70.87,25.73 71.98,24.62 ESP2.P$18 | v63.09,34.19 63.09,32.31 64.19,31.22 64.59,31.22 ESP2.P$19 | v17.88,44.27 16.9,45.26 10.76,45.26 | v40.59,64.24 43.71,64.24 | v74.57,19.25 74.55,19.25 74.05,19.75 | v37.82,57.12 37.82,57.23 38.1,57.51 | R18.1 16.48,62.1 15.62,62.1 15.29,62.43 15.29,64.82 16.66,66.19 v17.7,66.19 21.46,66.19 v25.38,62.28 | v25.07,66.9 28.6,63.37 28.6,58.47
  Top 0.406: v27.66,47.88 26.87,47.88 | v39.01,41.99 39.26,41.74 C4.- | 7.01,43.59 v7.11,43.69 | v43.99,69.9 38,69.9 v37.44,70.46 | R16.1 3.48,54.18 3.48,57.53 | v67.97,10.82 67.67,11.12 67.67,15.75 66.85,16.56 64.54,16.56 ESP3.P$13 | R5.1 48.77,52.93 47.68,54.03 47.68,54.59 R8.1 | R6.1 47.68,51.08 47.68,51.74 R5.1 | R5.1 50.52,52.83 52.12,54.43 v52.12,55.93 52.12,57.89 C5.1
  Top 0.813: 4.78,57.89 3.96,57.89 3.66,58.19 3.66,58.75 4.19,58.22 4.88,58.22 4.67,58.42 4.67,59.08 4.88,58.88 | 4.88,58.88 4.88,58.29 | 4.88,58.88 4.88,59.82 | ESP2.P$9 58.66,38.98 55.64,41.99 ESP3.P$9 | CP2.1 72.43,40.95 v71.58,40.95 | ESP2.P$19 68.17,30.4 v68.2,30.43 | ESP2.P$13 64.48,19.05 ESP3.P$13 | ESP2.P$18 74.05,19.75 ESP3.P$18 | 63.25,32.59 63.27,32.56 67.56,32.56 67.59,32.54 67.59,28.25 67.54,28.19 63.25,28.19 63.22,28.22 63.22,32.59 | ESP3.P$9 55.64,47.94 ESP1.15 | v48.23,46.63 51.63,43.24 ESP3.P$9 | 47.14,57.2 R10.2 R8.1 | R7.1 47.24,49.84 | 47.24,49.84 R6.1 | v45.82,49.63 47.04,49.63 47.24,49.84 | CP1.2 v52.38,66.39 v52.38,66.4
  Top 1.016: 4.47,37.13 4.41,37.2 DIN4.P$7 5.51,37.2 6.1,37.78 Q4.2 | v3.12,58.98 3.76,58.75 Q3.2 | Q2.2 16.43,58.75 | 16.43,58.75 11.25,58.75 7.72,55.22 v7.72,54.53 | R18.1 16.51,60.38 16.51,58.82 | 16.51,58.82 16.43,58.75 | C2.- 24.75,49.29 16.51,57.53 16.51,58.82 | v24.71,18.19 26.77,18.19 Q5.2 | REG.1 41.07,36.52 40.23,37.36 40.23,39.04 40.65,39.46 C4.-
  Top 2.54: C3.P$M 38.68,19.41 SERIAL6.6
  Top 3.175: 4.19,21.77 4.24,21.72 5.56,21.72 8.1,21.72 | 12.72,21.72 8.1,21.72 | 8.1,21.72 8.1,37.13 4.47,37.13 4.24,37.13 4.24,37.16 12.85,37.16
  Top 5.08: 4.12,21.61 DIN4.P$8 4.32,21.79 | 4.32,21.79 8.46,21.79 | 4.32,21.79 3.38,20.85 3.38,10.34 6.29,7.43 JACK.RING_SW 10.62,3.07 ATX.24
  Bottom 0.254: 11.02,49.02 12.17,49.02 12.17,49.58 10.76,49.58 | 10.76,49.58 Q1.S | 9.63,49.58 10.76,49.58
  Bottom 0.406: WELL_TEMP.2 41.91,54.97 40.01,53.06 38.84,53.06 37.62,51.84 v37.34,51.84 37.34,46 36.7,45.36 33.5,45.36 v33.05,45.82 | IO0.2 53.92,10.89 ATX.3 | ATX.7 34.8,8.58 34.8,10.24 | 13.79,3.07 ATX.24 | v7.72,54.53 7.72,63.93 v9.2,65.41 7.49,67.11 2.21,67.11 v1.25,66.14 | v70.56,35.64 68.56,35.64 68.2,35.99 | v1.83,49.33 7.7,49.33 7.8,49.23 | v37.67,24.41 42.24,24.41 | v42.14,27.03 42.14,26.98 42.24,26.87 | v31.9,33.17 25.45,33.17 v24.31,34.31 21.42,37.2 DIN4.P$6 16.46,33.54 v16.46,32.72 | v43.59,16.03 42.9,16.03 40.09,18.83 | 64.49,23.98 58.06,23.98 v56.74,25.3 | v52.12,55.93 56.31,55.93 v57.43,57.05
  Bottom 0.813: v71.58,40.95 68.38,40.95 | 68.38,40.95 56.69,40.95 55.64,41.99 ESP3.P$9 | 68.38,40.95 68.2,40.77 68.2,35.99 v68.2,30.43 65.51,30.43 64.49,29.41 64.49,23.98 64.49,19.07 | ESP3.P$13 64.49,19.07 | 64.49,19.07 64.75,19.33 74.47,19.33 ESP3.P$18 | 44.53,46.81 44.53,44.98 46.61,42.9 46.61,40.21 42.24,35.84 42.24,26.87 42.24,24.41 42.24,21.31 | v48.23,46.63 44.65,46.63 44.53,46.81 | WELL_TEMP.2 41.91,57.68 | 41.91,57.68 41.91,58.27 v43.71,60.07 43.71,60.55 48.01,64.85 50.83,64.85 v52.38,66.4 | 34.8,3.07 ATX.19 35.2,3.47 35.2,12.9 35.46,13.16 38.71,13.16 38.79,13.23 38.79,17.53 40.09,18.83 42.24,20.98 42.24,21.31 | SERIAL4.4 42.24,21.31 | v28.7,56.74 31.7,53.75 31.7,51.74 32.18,51.26 34.31,51.26 34.92,51.87 34.92,54.2 38.23,57.51 41.73,57.51 41.91,57.68 | v7.72,54.53 7.72,57.86 6.6,58.98 v3.12,58.98 | 44.53,46.81 44.53,48.34 v45.82,49.63
  Bottom 1.016: 9.63,49.58 7.72,47.68 | v7.72,54.53 7.72,46.94 8.48,47.7 8.48,49.23 10.44,49.23 Q1.S 10.62,49.7 10.62,49.81 7.8,49.81 7.8,49.23 7.8,48.74 | v24.71,18.19 24.71,13.54
  Bottom 1.626: RST.2 RST.3
  Bottom 2.54: 9.75,47.78 11.02,47.78 11.02,49.02 | SERIAL6.6 34.81,13.18
  Bottom 3.175: DIN4.P$8 8.1,21.8 DIN4.P$4 DIN4.P$3 8.1,37.2 DIN4.P$7
  Bottom 5.08: ATX.17 ATX.18 ATX.19 | 3.39,10.3 JACK.RING 3.39,20.89 DIN4.P$8 DIN4.P$9 12.8,16.05 15.32,13.54 24.71,13.54 34.81,13.54 34.81,13.18 ATX.7 | DIN4.P$7 DIN4.P$6 9.75,37.2 9.75,47.78 | ATX.17 ATX.16 ATX.15 ATX.3 | 13.79,3.07 10.59,3.07 3.43,10.24 | 34.85,3.02 34.8,3.07 34.8,10.24 | ATX.5 ATX.17
  other vias: 71.78,3.2 51.74,29.44 61.8,5.87
  pour Top (isolate 0.254): 1,72 70,72 70,48 73,48 73,21 78,21 78,1 1,1
  pour Bottom (isolate 0.254): 1,72 70,72 70,48 73,48 73,21 78,21 78,1 1,1
HEATER  (via drill 0.6)
  Top 0.406: R17.1 v19.05,64.95 | ESP3.P$6 64.48,42.03 ESP2.P$6 | v57.89,45.39 57.89,48.19 ESP1.16 57.9,48.86 56.9,49.86 50.16,49.86 R7.2 47.85,47.55 44.98,47.55 44.7,47.83 44.7,56.13 40.26,60.58 v40.26,61.09
  Bottom 0.406: v19.05,64.95 19.58,65.48 19.58,69.8 20.95,71.17 33.4,71.17 37.67,66.9 37.67,62.23 38.81,61.09 v40.26,61.09 | ESP3.P$6 63.26,45.27 62.56,45.97 58.47,45.97 v57.89,45.39
HEATER_TEMP  (via drill 0.6)
  Top 0.406: 30.48,48.39 IC2.P$5 31.53,48.4 31.85,48.08 31.85,47.65 32.05,47.45 v33.05,47.45 | RT.1 31.8,68.78 HEATER_TEMP.2
  Bottom 0.406: HEATER_TEMP.2 27.43,70.51 24.23,70.51 23.42,69.7 23.42,49.53 28.35,44.6 31.24,44.6 31.88,45.24 31.88,46.43 32.89,47.45 v33.05,47.45
HIGH_TEMP  (via drill 0.6)
  Top 0.406: MODE.3 68.49,6.82 66.9,8.41 63.78,8.41 RESET.2 | MODE.2 73.42,17.45 ESP3.P$17 72.09,19.18 71.09,19.18 70.48,19.8 ESP2.P$17 70.48,23.38 67.16,26.7 62.71,26.7 61.75,27.66 v61.75,35.38 | v57.3,38.15 57.3,38.94 56.52,39.73 50.65,39.73 49.89,40.49 48.87,40.49 48.39,40.97 48.39,43.84 46.86,45.36 40.41,45.36 38.93,46.84 IC1.4 | ESP1.4 63.9,60.93 62.76,59.79 v62.76,59.33 | R8.2 48.79,54.99 48.79,54.97 49.71,54.05 v50.01,54.05
  Bottom 0.406: v61.75,35.38 60.33,36.8 58.06,36.8 57.3,37.57 v57.3,38.15 57.3,38.94 54.43,41.81 54.43,44.63 56.44,46.63 65.35,46.63 66.4,47.68 66.4,58.45 65.66,59.18 62.92,59.18 v62.76,59.33 61.37,59.33 56.59,54.56 50.52,54.56 v50.01,54.05
  Bottom 1.626: MODE.3 MODE.2
N$1
  Top 0.406: RL1.2 32.51,61.98 RL2.1
N$2
  Top 1.016: HEATER_POWER.2 27.06,62.88 Q2.3
N$3
  Top 0.406: Q1.D
  Top 1.27: 28.5,34.67 30.4,34.67 30.4,31.32 29.13,31.32 27.13,33.33 28.5,33.33 29.64,32.18 29.64,31.58 RELAY.P$5
  Top 2.54: Q1.D 16.18,52.09
  Top 5.08: HEATSINK.P$1 16.84,52.09 28.5,40.44 28.5,34.67
  Bottom 2.54: Q1.D HEATSINK.P$1
N$4
  Top 0.813: R21.2 6.35,60.2 Q3.3
  Top 1.016: FAN.3 8.63,60.45 Q3.3
N$5
  Top 0.406: Q6.3 6.35,45.47 R14.2 7.49,48.9 7.49,52.83 | Q1.G 8.96,52.83 7.49,52.83 | 7.49,52.83 R16.2 4.83,54.36 R15.1
N$8
  Top 0.406: Q3.1 4.7,61.34 R20.2 R19.2
N$27
  Top 0.406: RH.1 35,64.57 35,59.56 35.66,58.9 35.66,55.22 39.88,51 IC1.2
N$30
  Top 0.406: Q6.1 4.83,46.35 R14.1 6.35,49.28 R13.2
N$32
  Top 0.406: R18.2 17.53,63.65 R17.2 23.42,62.13 Q2.1
N$33
  Top 1.016: RELAY.P$3 16.37,34.84 15.65,35.56 15.65,38.3 13.97,39.98 11.86,39.98 10.05,41.79 D1.1 9.59,41.4 Q4.3
N$34
  Top 0.406: Q4.1 5.97,42.29 R11.2
N$35
  Top 0.406: Q5.1 28.25,14.99 30.07,16.82 R12.1
N$36
  Top 1.016: D2.1 23.39,16.18 | D2.1 Q5.3 | 23.47,15.88 D2.1 | RELAY.P$7 28.24,24.03 23.95,24.03 22.35,22.43 22.35,17.75 23.68,16.42 D2.1
N$92
  Top 0.406: IC2.P$6 28.98,47.13 C1.2
PEL_PWM  (via drill 0.6)
  Top 0.406: R13.1 2.16,52.96 2.16,64.39 2.69,64.92 2.79,65.02 8.61,70.84 34.34,70.84 38.15,67.03 38.15,58.65 38.63,58.17 41.73,58.17 44.04,55.85 44.04,46.41 44.42,46.02 47.24,46.02 49.05,44.22 49.05,41.71 49.35,41.4 v50.01,41.4 | ESP3.P$10 56.45,17.84 59.98,21.37 ESP2.P$10 59.98,23.11 57.78,25.3 57.78,29.18 56.62,30.35 v56.62,31.17 | ESP1.19 63.9,48.77 63.5,49.17 63.5,49.81 61.85,51.46 v61.85,53.82
  Bottom 0.406: v61.85,53.82 61.42,53.39 61.42,51.1 60.91,50.6 54,50.6 50.47,47.07 50.47,41.86 v50.01,41.4 49.66,41.05 49.66,38 51.08,36.58 51.08,35.26 51.31,35.03 53.42,35.03 56.62,31.83 v56.62,31.17
PEL_SWA  (via drill 0.6)
  Top 0.406: R11.1 3.43,43.05 3.43,50.09 1.5,52.02 1.5,64.77 8.23,71.5 34.8,71.5 38.81,67.49 38.81,64.21 41.22,61.8 41.22,60.76 45.36,56.62 45.36,52.38 v46.02,51.71 47.14,52.83 R5.2 | ESP3.P$4 67.48,42.37 ESP2.P$4 | v64.08,55.88 63.02,55.88 61.06,57.84 61.06,60.6 60.55,61.11 59.92,61.11 59.46,61.57 v59.46,62.1 59.46,63.41 59.9,63.85 ESP1.6
  Bottom 0.406: ESP3.P$4 67.72,43.87 67.72,59.38 66.6,60.5 64.82,60.5 63.63,61.7 62.1,61.7 61.52,61.11 59.92,61.11 59.46,61.57 v59.46,62.1 | v64.08,55.88 63.63,55.88 63.12,56.39 61.47,56.39 57.66,52.58 52.78,52.58 51.92,51.71 v46.02,51.71
PEL_SWB  (via drill 0.6)
  Top 0.406: ESP3.P$5 65.98,43.07 ESP2.P$5 | R12.2 31.04,18.34 33.12,20.42 33.12,27.66 36.96,31.5 39.5,31.5 40.16,30.84 44.2,30.84 44.53,31.17 44.53,34.14 v45.77,35.38 | ESP1.7 57.9,61.94 59.84,59.99 v60.05,59.99 60.05,57.28 v62.05,55.27 | R6.2 50.39,50.65 v50.52,50.77
  Bottom 0.406: ESP3.P$5 67.06,44.49 67.06,58.95 66.17,59.84 64.47,59.84 63.27,61.04 62.43,61.04 61.39,59.99 v60.05,59.99 | 51.21,49.96 49.15,47.9 49.15,43.28 47.47,41.6 47.47,39.65 45.77,37.95 v45.77,35.38 | 51.21,49.96 53.16,51.92 57.99,51.92 61.34,55.27 v62.05,55.27 | v50.52,50.77 51.21,50.09 51.21,49.96
RED  (via drill 0.6)
  Top 0.254: v32.87,30.2 33.1,30.2 33.47,30.57 | v31.37,25.25 31.37,28.19 31.39,28.22
  Top 0.406: RELAY.P$8 25.65,21.21
  Top 2.54: 25.65,21.21 26.09,20.78 v29.77,20.78 30.28,20.78 31.39,21.89 31.39,28.22 31.39,28.5 33.47,30.57 34.04,31.14 34.04,34.98
  Bottom 2.54: 25.65,21.23 26.11,20.78 v29.77,20.78 30.28,20.78 31.39,21.89 31.39,28.5 34.02,31.13 PELTIER.1
RESET  (via drill 0.6)
  Top 0.406: RESET.1 61.54,11.73 64.21,9.07 70.59,9.07 RST.4 | ESP1.1 69.9,62.18 64.97,57.25 v64.64,57.25 | RST.1 71.16,12.5 69.22,12.5 68.34,13.37 ESP3.P$15 67.48,18.71 ESP2.P$15 67.48,24.09 66.19,25.38 61.82,25.38 60.43,26.77 60.43,32.89 59.36,33.96 v59.36,34.87 | R1.2 49.66,60.68 v50.24,60.68
  Bottom 0.406: v59.36,34.87 59.08,35.15 57.53,35.15 55.65,37.03 55.65,38.58 53.11,41.12 53.11,45.36 55.7,47.95 64.75,47.95 65.08,48.28 65.08,56.82 v64.64,57.25 61.32,57.25 57.3,53.24 52.48,53.24 51.61,52.38 48.56,52.38 48.06,52.88 48.06,58.5 v50.24,60.68
  Bottom 1.626: RST.1 RST.4
RXD  (via drill 0.6)
  Top 0.406: ESP3.P$11 60.26,19.91 61.04,19.91 61.48,20.35 ESP2.P$11 61.48,23.13 61.21,23.39 60.66,23.39 58.45,25.6 58.45,30.2 v58.12,30.53 | ESP1.21 67.9,51.15 65.18,53.87 v64.01,53.87
  Bottom 0.406: SERIAL6.3 46.3,15.21 47.6,16.51 56.85,16.51 ESP3.P$11 58.18,21.75 56.44,23.5 53.09,23.5 52.65,23.06 SERIAL4.2 | v64.01,53.87 63.65,53.87 62.08,52.3 62.08,50.24 61.77,49.94 54.56,49.94 51.13,46.51 51.13,40.03 52.98,38.18 52.98,36.52 57.61,31.9 57.61,31.04 v58.12,30.53
SCLK  (via drill 0.6)
  Top 0.406: IC2.P$13 36.13,49.67 37.49,48.31 37.49,46.35 39.8,44.04 46.02,44.04 47.07,43 47.07,38.91 47.52,38.46 50.52,38.46 v50.8,38.73 | ESP3.P$3 68.98,41.33 ESP2.P$3 68.98,37.43 68.02,36.47 52.53,36.47 v51.99,35.94 | ESP1.5 61.9,62.64 61.62,62.36 61.06,62.36 v60.81,62.1
  Bottom 0.406: ESP3.P$3 70.88,44 68.38,46.51 68.38,59.77 66.98,61.16 65.2,61.16 64.01,62.36 61.06,62.36 v60.81,62.1 | v51.99,35.94 51.99,37.54 v50.8,38.73
SDIO  (via drill 0.6)
  Top 0.406: ESP2.P$7 62.98,40.99 ESP3.P$7 59.9,44.06 ESP1.17 59.9,52.01 v59.82,52.09 | v33.07,52.5 33.3,52.5 34.75,51.05 35.55,51.05 IC2.P$14 36.08,50.94 38.15,48.87 38.15,46.66 40.11,44.7 46.43,44.7 47.73,43.41 47.73,40.18 v48.51,39.4 | R3.2 49.23,66.4 v50.37,66.4
  Bottom 0.406: v59.82,52.09 58.98,51.26 53.54,51.26 49.81,47.52 49.81,42.88 48.13,41.2 48.13,39.78 v48.51,39.4 | v33.07,52.5 33.07,56.69 34.82,58.45 40.21,58.45 48.16,66.4 v50.37,66.4
TOUT  (via drill 0.6)
  Top 0.406: ESP1.2 67.9,61.27 64.8,58.17 v62.51,58.17 | ESP3.P$16 68.98,19.75 ESP2.P$16 68.98,23.66 66.6,26.04 62.31,26.04 61.09,27.25 61.09,33.93 60.63,34.39 v60.58,34.39 | R9.1 R10.1 48.82,57.2 49.86,56.16 v50.29,56.16
  Bottom 0.406: v60.58,34.39 60.58,35.43 59.87,36.14 57.63,36.14 56.31,37.47 56.31,38.94 53.77,41.48 53.77,44.98 56.08,47.3 65.05,47.3 65.73,47.98 65.73,57.84 65.41,58.17 v62.51,58.17 61.21,58.17 56.95,53.9 52.17,53.9 51.31,53.03 49.17,53.03 48.72,53.49 48.72,54.59 v50.29,56.16
TXD  (via drill 0.6)
  Top 0.406: ESP3.P$12 62.98,20.09 ESP2.P$12 62.98,23.41 62.33,24.05 61.06,24.05 59.11,26.01 59.11,31.45 v58.7,31.85 | ESP1.22 69.9,50.27 65.28,54.89 63.35,54.89 62.87,54.41 62.87,52.96 63.42,52.4 v63.96,52.4
  Bottom 0.406: SERIAL6.2 48.84,15.21 49.48,15.85 58.73,15.85 ESP3.P$12 60.72,20.28 56.84,24.16 50.72,24.16 50.11,23.55 SERIAL4.3 | v63.96,52.4 63.42,52.4 62.81,51.79 62.81,49.68 62.41,49.28 54.91,49.28 51.79,46.15 51.79,40.41 53.65,38.56 53.65,36.93 58.7,31.88 v58.7,31.85
WELL_TEMP  (via drill 0.6)
  Top 0.406: RL2.2 34.04,64.01 RH.2 32.21,65.84 v30.5,65.84 | v33.07,49.02 32.03,49.02 31.77,49.28 31.77,50.65 31.62,50.8 30.61,50.8 IC2.P$3
  Bottom 0.406: v30.5,65.84 24.61,65.84 24.08,65.3 24.08,49.89 28.6,45.36 30.76,45.36 31.04,45.64 31.04,46.69 32.03,47.68 32.03,48.31 32.74,49.02 v33.07,49.02 33.43,49.02 34.11,48.34 34.11,46.58 34.52,46.18 36.07,46.18 36.32,46.43 36.32,52.48 38.2,54.36 38.79,54.36 39.37,54.94 WELL_TEMP.1

### Text on the board
tPlace: HPWR(WHITE) | HTEMP(PINK) | NinjaPCB ver2.2 | R2 | RT* | WELL / TEMP | R3 | CP1 | R19* | R17* | RH | R20 | R4 | FAN | RL2 | R1 | Q3 | R18 | R22* | RL1 | ^R9 | ^R21 | Q2 | R10 | RD2 | C5 | R15 | R8 | ESP1 / ESP-12 | RD1 | Q1 | R16 | C2 | R5 | R13* | R6 | IC2 | R7 | ^R14 | IC1 | Q6 | C1 | C4 | CP2 | R11 | Q4 | D1 | RED / PELT / BLACK | REG | ESP2 / ESP-WROOM-02 | + | RELAY | DIN4 | C3 | JACK | R12 | D2 | Q5
bPlace: NinjaPCB | SERIAL4 | SERIAL6 | IO0 | M | R | ATX | MODE | RST
tDocu: pipe | lid | well | center | 79 x 73 mm